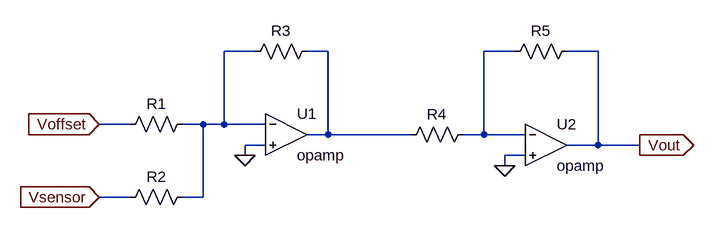
[diagram p0: schematic Draft1.asc]
Draft1.asc, the LTspice schematic file:
Version 4
SHEET 1 880 680
WIRE 80 32 32 32
WIRE 192 32 160 32
WIRE 480 32 432 32
WIRE 608 32 560 32
WIRE -112 144 -160 144
WIRE 0 144 -32 144
WIRE 32 144 32 32
WIRE 32 144 0 144
WIRE 96 144 32 144
WIRE 192 160 192 32
WIRE 192 160 160 160
WIRE 320 160 192 160
WIRE 432 160 432 32
WIRE 432 160 400 160
WIRE 496 160 432 160
WIRE 96 176 64 176
WIRE 608 176 608 32
WIRE 608 176 560 176
WIRE 672 176 608 176
WIRE 64 192 64 176
WIRE 496 192 464 192
WIRE 464 208 464 192
WIRE -112 256 -160 256
WIRE 0 256 0 144
WIRE 0 256 -32 256
FLAG 64 192 0
FLAG -160 144 Voffset
IOPIN -160 144 In
FLAG -160 256 Vsensor
IOPIN -160 256 In
FLAG 464 208 0
FLAG 672 176 Vout
IOPIN 672 176 Out
SYMBOL Opamps\\opamp 128 96 R0
SYMATTR InstName U1
SYMBOL Opamps\\opamp 528 112 R0
SYMATTR InstName U2
SYMBOL res 176 16 R90
WINDOW 0 0 56 VBottom 2
WINDOW 3 32 56 VTop 2
SYMATTR InstName R3
SYMATTR Value ""
SYMBOL res -16 128 R90
WINDOW 0 0 56 VBottom 2
WINDOW 3 32 56 VTop 2
SYMATTR InstName R1
SYMATTR Value ""
SYMBOL res -16 240 R90
WINDOW 0 0 56 VBottom 2
WINDOW 3 32 56 VTop 2
SYMATTR InstName R2
SYMATTR Value ""
SYMBOL res 416 144 R90
WINDOW 0 0 56 VBottom 2
WINDOW 3 32 56 VTop 2
SYMATTR InstName R4
SYMATTR Value ""
SYMBOL res 576 16 R90
WINDOW 0 0 56 VBottom 2
WINDOW 3 32 56 VTop 2
SYMATTR InstName R5
SYMATTR Value ""

The netlist it stands for:
* Draft1.asc
XU1 N001 0 N002 opamp Aol=100K GBW=10Meg  ; pins invin noninvin out
XU2 N003 0 Vout opamp Aol=100K GBW=10Meg  ; pins invin noninvin out
R3 N002 N001
R1 N001 Voffset
R2 N001 Vsensor
R4 N003 N002
R5 Vout N003
.backanno
.end